# EAGLE design ampli (EAGLE 6.5.0)
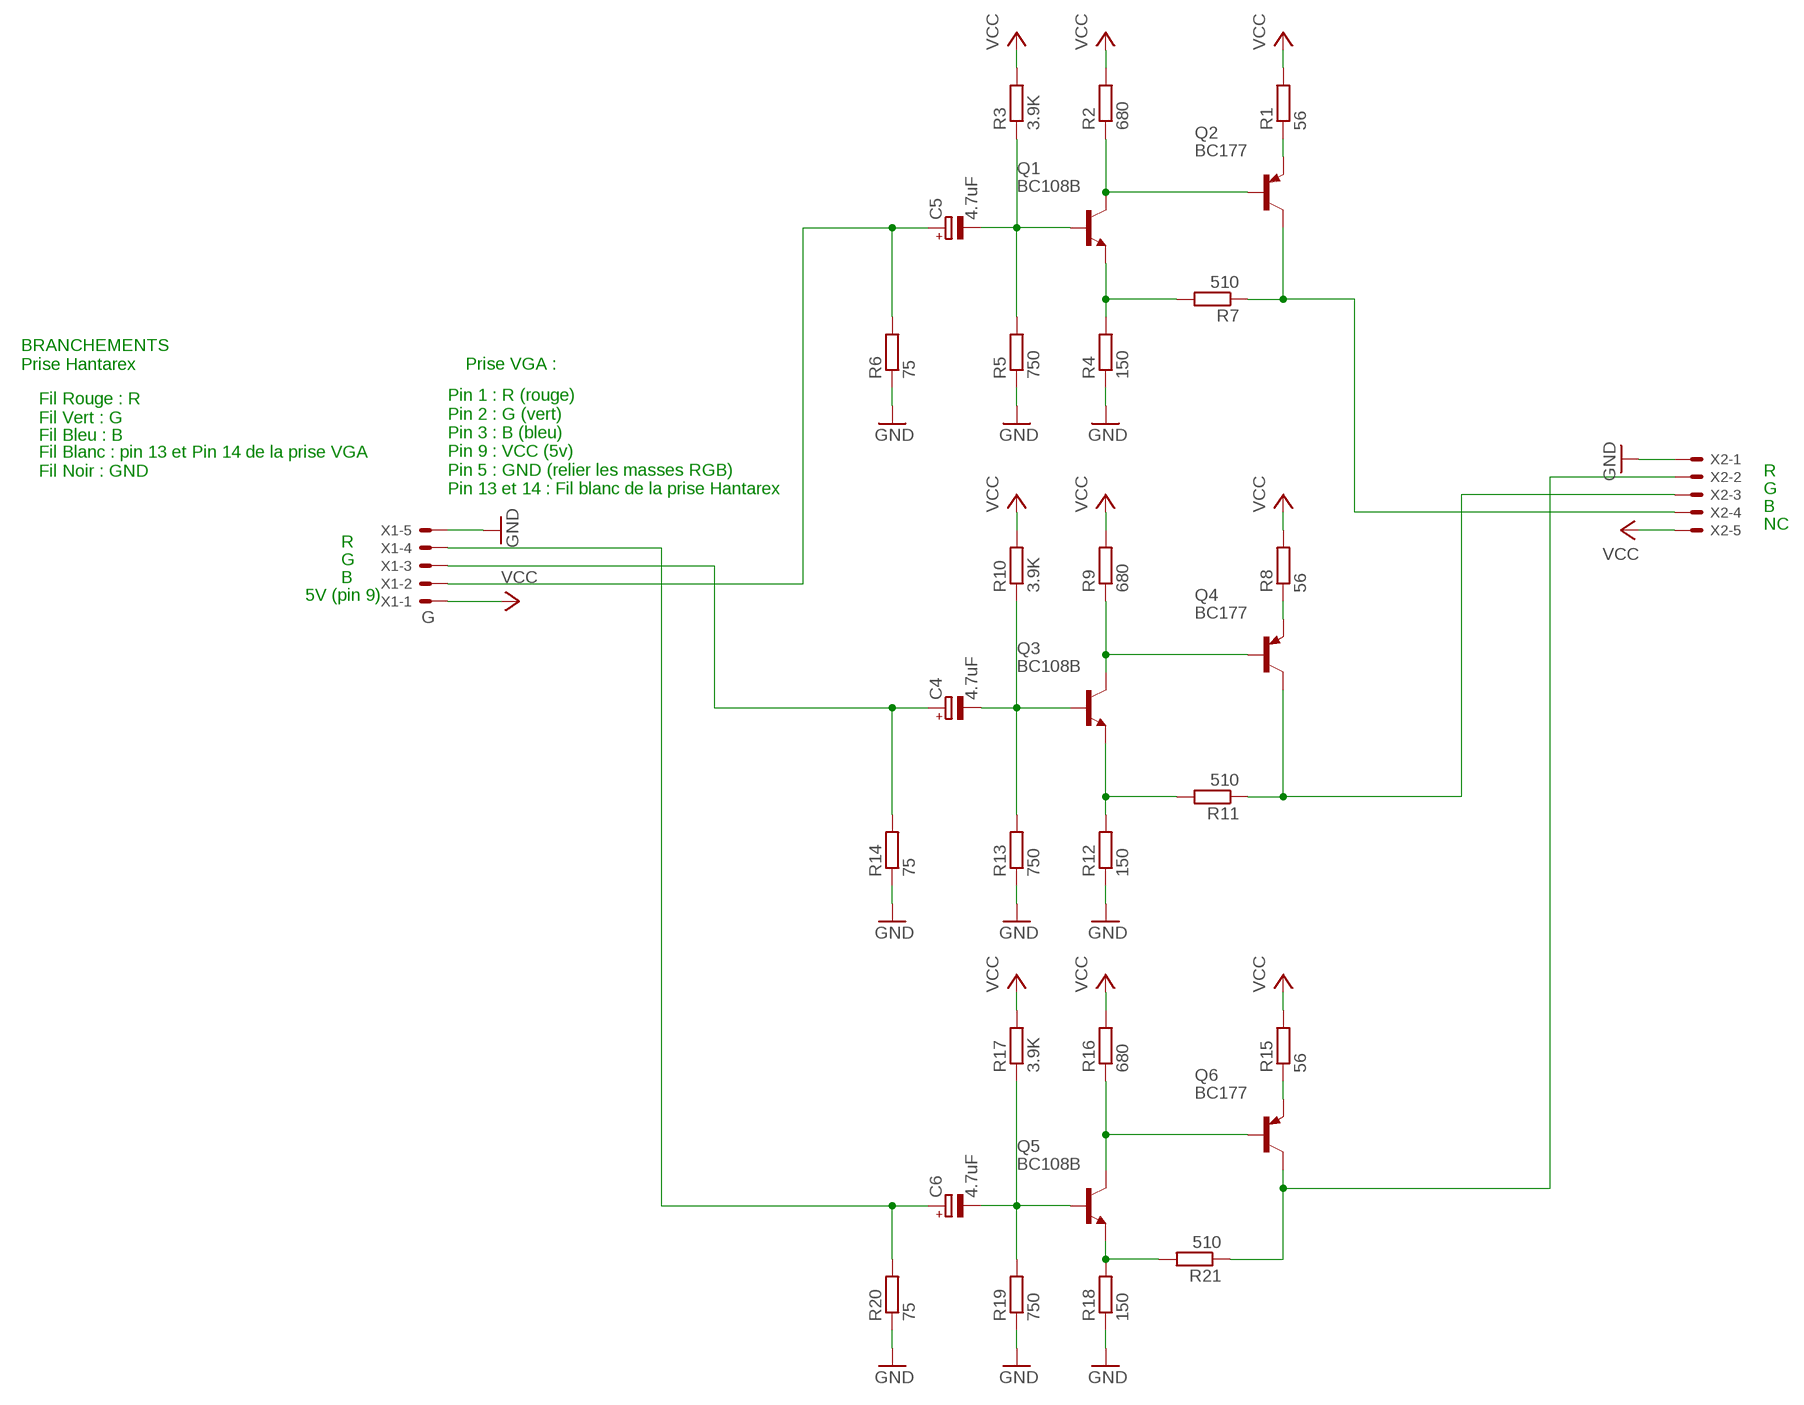
[diagram p0: schematic, sheet 1]

## Parts
C4  4.7uF  CPOL-EUE5-10.5  [E5-10,5]
C5  4.7uF  CPOL-EUE5-10.5  [E5-10,5]
C6  4.7uF  CPOL-EUE5-10.5  [E5-10,5]
Q1  BC108B  [TO18]
Q2  BC177  [TO18]
Q3  BC108B  [TO18]
Q4  BC177  [TO18]
Q5  BC108B  [TO18]
Q6  BC177  [TO18]
R1  56  R-EU_0207/10  [0207/10]
R2  680  R-EU_0207/10  [0207/10]
R3  3.9K  R-EU_0207/10  [0207/10]
R4  150  R-EU_0207/10  [0207/10]
R5  750  R-EU_0207/10  [0207/10]
R6  75  R-EU_0207/10  [0207/10]
R7  510  R-EU_0207/10  [0207/10]
R8  56  R-EU_0207/10  [0207/10]
R9  680  R-EU_0207/10  [0207/10]
R10  3.9K  R-EU_0207/10  [0207/10]
R11  510  R-EU_0207/10  [0207/10]
R12  150  R-EU_0207/10  [0207/10]
R13  750  R-EU_0207/10  [0207/10]
R14  75  R-EU_0207/10  [0207/10]
R15  56  R-EU_0207/10  [0207/10]
R16  680  R-EU_0207/10  [0207/10]
R17  3.9K  R-EU_0207/10  [0207/10]
R18  150  R-EU_0207/10  [0207/10]
R19  750  R-EU_0207/10  [0207/10]
R20  75  R-EU_0207/10  [0207/10]
R21  510  R-EU_0207/10  [0207/10]
X1  G  KK-156-5  [KK-156-5]
X2  KK-156-5  [KK-156-5]

## Nets
G: C4.+ R14.2 X1.3
GND: R4.1 R5.1 R6.1 R12.1 R13.1 R14.1 R18.1 R19.1 R20.1 X1.5 X2.1
N$1: Q1.3(C) Q2.2(B) R2.1
N$2: Q1.1(E) R4.2 R7.2
N$3: Q2.3(C) R7.1 X2.4
N$4: Q2.1(E) R1.1
N$5: C5.- Q1.2(B) R3.1 R5.2
N$6: C6.+ R20.2 X1.4
N$7: C6.- Q5.2(B) R17.1 R19.2
N$8: Q5.3(C) Q6.2(B) R16.1
N$9: Q5.1(E) R18.2 R21.2
N$10: Q6.3(C) R21.1 X2.2
N$11: Q6.1(E) R15.1
N$13: Q3.1(E) R11.2 R12.2
N$14: C4.- Q3.2(B) R10.1 R13.2
N$16: Q3.3(C) Q4.2(B) R9.1
N$17: Q4.3(C) R11.1 X2.3
N$18: Q4.1(E) R8.1
R: C5.+ R6.2 X1.2
VCC: R1.2 R2.2 R3.2 R8.2 R9.2 R10.2 R15.2 R16.2 R17.2 X1.1 X2.5

## Notes on the sheet
- BRANCHEMENTS
  Prise Hantarex
- Prise VGA :
- Fil Rouge : R
  Fil Vert : G
- Fil Bleu : B
- Fil Blanc : pin 13 et Pin 14 de la prise VGA
  Fil Noir : GND
- R
- Pin 1 : R (rouge)
  Pin 2 : G (vert)
  Pin 3 : B (bleu)
  Pin 9 : VCC (5v)
  Pin 5 : GND (relier les masses RGB)
  Pin 13 et 14 : Fil blanc de la prise Hantarex
- G
- B
- NC
- R
- G
- B
- 5V (pin 9)

## Library data of the parts
C4-C6 = resistor:CPOL-EU: POLARIZED CAPACITOR, European symbol
Q1 Q3 Q5 = transistor-npn:BC108B: NPN Transistor
Q2 Q4 Q6 = transistor-pnp:BC177*: PNP Transistor
R1-R21 = resistor:R-EU_: RESISTOR, European symbol
X1 X2 = con-molex:KK-156-5: KK 156 HEADER Source: http://www.molex.com/pdm_docs/sd/026604100_sd.pdf; OC_FARNELL: unknown; OC_NEWARK: unknown

## Board
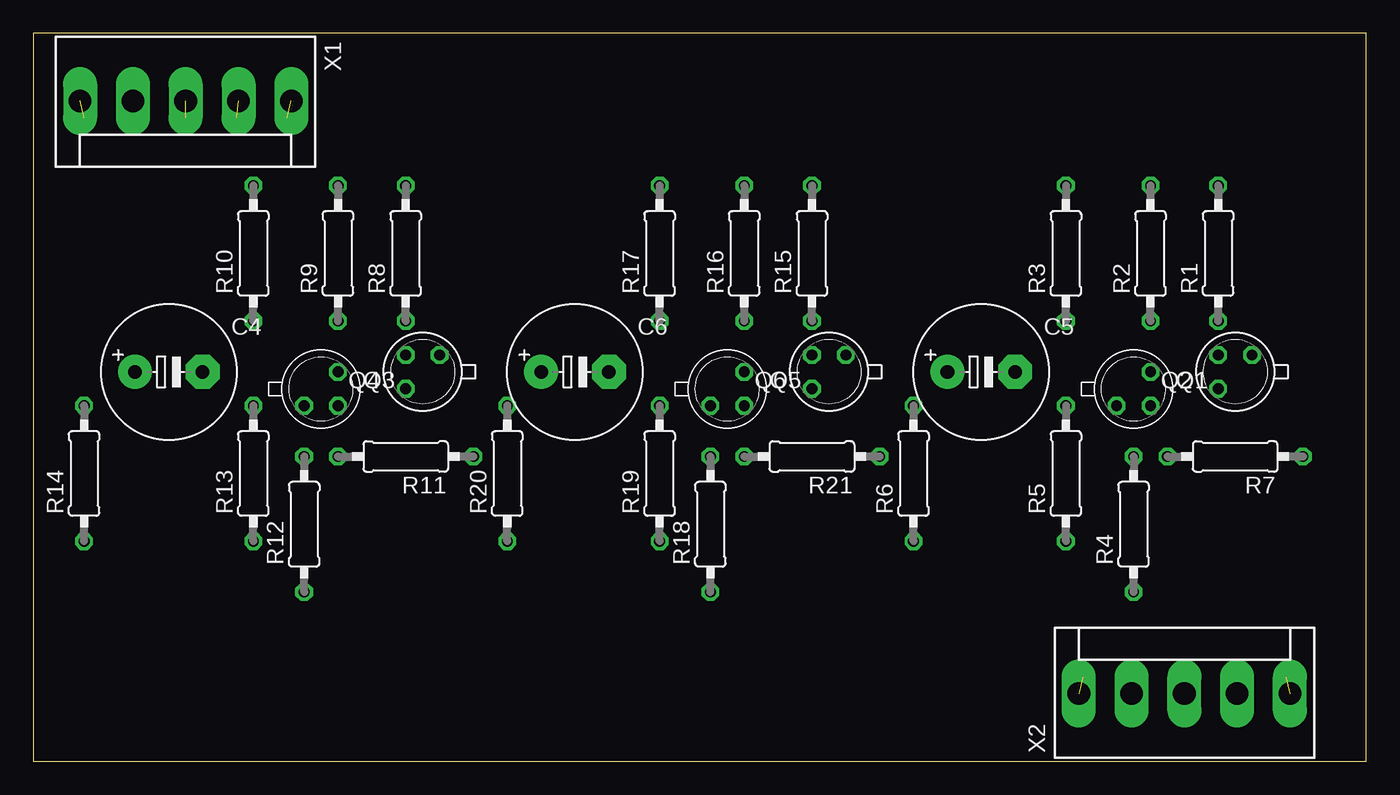
[diagram p1: board, top side]
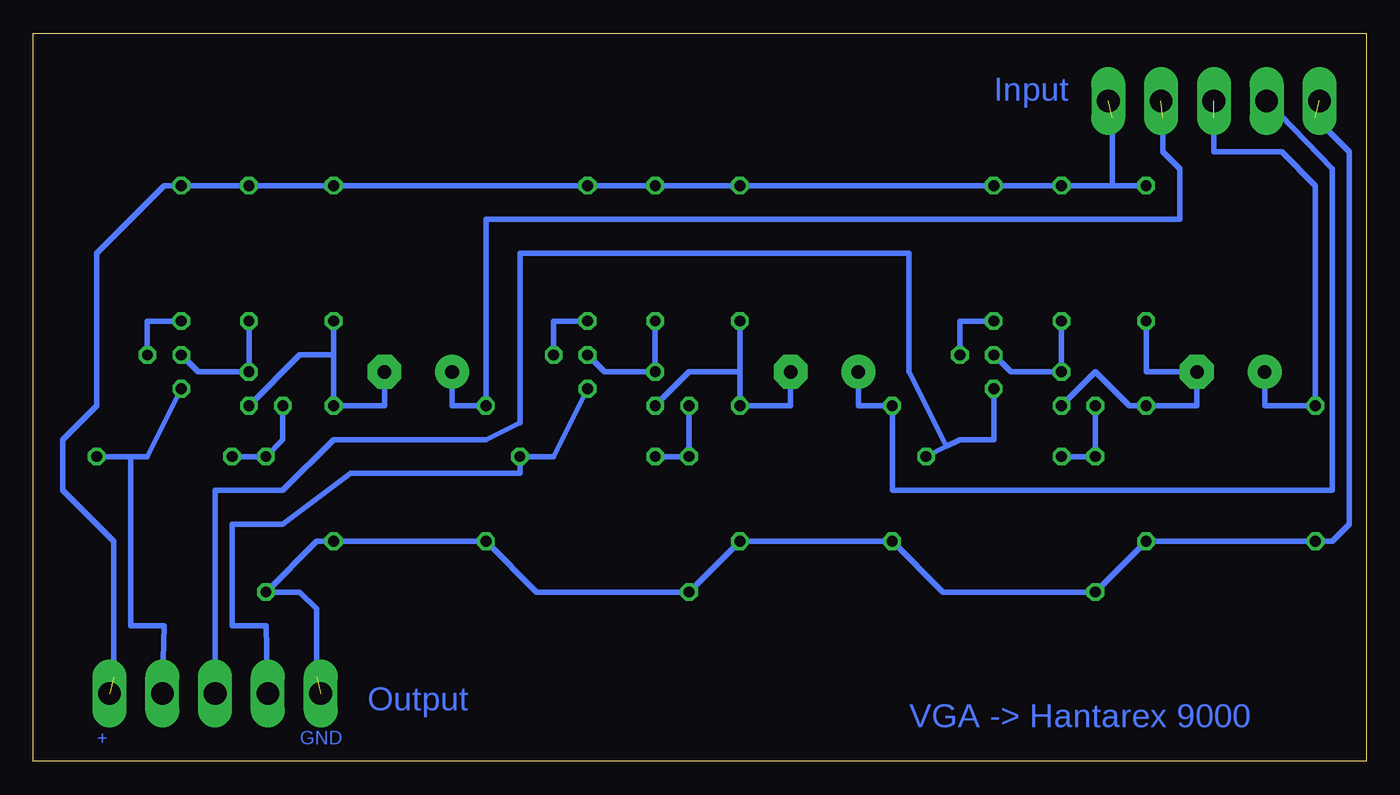
[diagram p2: board, bottom side, seen from below]

Size 100 x 54.6 mm. Coordinates in mm from the lower left corner, seen from the top.
Outline: 0,0 100,0 100,54.6 0,54.6 0,0
Copper layers (1*16): Top 0.035mm / dielectric 1.5mm / Bottom 0.035mm
Design rules "default": minimum track width 10mil, minimum drill 24mil, track to track 8mil, track to pad 8mil, pad to pad 8mil, via to via 8mil, smd to smd 8mil, copper to edge 40mil, drill to drill 8mil, minimum pad ring 10mil, minimum via ring 8mil, stop-mask expansion 4mil, vias tented up to drill 0mil, thermal gap 10mil

### Footprints (pad centres in the part's own frame; a part is rotated, then mirrored left to right if it is on the bottom)
E5-10,5 = drill 1.016 pad 2.54: + -2.54,0 | drill 1.016 pad 2.54 octagon: - 2.54,0
TO18 = drill 0.813 octagon: 1 -1.27,-1.27; 2 1.27,-1.27; 3 1.27,1.27
0207/10 = drill 0.813 octagon: 1 -5.08,0; 2 5.08,0
KK-156-5 = drill 1.7 pad 2.184 long: 1 -7.92,0; 2 -3.96,0; 3 0,0; 4 3.96,0; 5 7.92,0

### Placement (x,y rotation side)
C4  10.16,29.21 0 top
C5  71.12,29.21 0 top
C6  40.64,29.21 0 top
Q1  82.55,27.94 0 top
Q2  90.17,29.21 180 top
Q3  21.59,27.94 0 top
Q4  29.21,29.21 180 top
Q5  52.07,27.94 0 top
Q6  59.69,29.21 180 top
R1  88.9,38.1 90 top
R2  83.82,38.1 90 top
R3  77.47,38.1 90 top
R4  82.55,17.78 90 top
R5  77.47,21.59 90 top
R6  66.04,21.59 90 top
R7  90.17,22.86 180 top
R8  27.94,38.1 90 top
R9  22.86,38.1 90 top
R10  16.51,38.1 90 top
R11  27.94,22.86 180 top
R12  20.32,17.78 90 top
R13  16.51,21.59 90 top
R14  3.81,21.59 90 top
R15  58.42,38.1 90 top
R16  53.34,38.1 90 top
R17  46.99,38.1 90 top
R18  50.8,17.78 90 top
R19  46.99,21.59 90 top
R20  35.56,21.59 90 top
R21  58.42,22.86 180 top
X1  11.43,49.53 180 top
X2  86.36,5.08 0 top

### Tracks (layer width: path | path; a pad name or v marks a point on that pad's centre or on a via)
G  (1 unrouted)
  Bottom 0.406: C4.+ 7.62,26.67 R14.2 3.81,43.18 6.35,45.72 11.43,45.72 11.43,48.26
GND  (2 unrouted)
  Bottom 0.406: 78.74,6.35 78.74,11.43 80.01,12.7 R4.1 78.74,16.51 R5.1 R6.1 62.23,12.7 R18.1 R19.1 R20.1 31.75,12.7 R12.1 R13.1 R14.1 2.54,16.51 1.27,17.78 1.27,45.72 3.81,48.26
N$1
  Bottom 0.406: Q2.2 87.63,29.21 Q1.3 R2.1
N$2
  Bottom 0.406: Q1.1 81.28,24.13 R4.2 R7.2
N$3
  Bottom 0.406: 92.71,22.86 91.44,22.86 Q2.3 | 92.71,22.86 R7.1 | X2.4 90.17,10.16 92.71,10.16 92.71,22.86
N$4
  Bottom 0.406: Q2.1 91.44,33.02 R1.1
N$5
  Bottom 0.406: C5.- 73.66,26.67 R5.2 77.47,30.48 | 77.47,30.48 R3.1 | 77.47,30.48 80.01,30.48 Q1.2
N$6
  Bottom 0.406: C6.+ 38.1,26.67 R20.2 35.56,20.32 2.54,20.32 2.54,44.45 X1.4
N$7
  Bottom 0.406: C6.- 43.18,26.67 R19.2 46.99,29.21 | R17.1 46.99,29.21 | 46.99,29.21 50.8,29.21 Q5.2
N$8
  Bottom 0.406: Q6.2 57.15,29.21 Q5.3 R16.1
N$9
  Bottom 0.406: Q5.1 R18.2 R21.2
N$10
  Bottom 0.406: Q6.3 60.96,22.86 R21.1 63.5,21.59 76.2,21.59 81.28,17.78 85.09,17.78 85.09,10.16 82.55,10.16 X2.2
N$11
  Bottom 0.406: Q6.1 60.96,33.02 R15.1
N$13
  Bottom 0.406: Q3.1 R12.2 R11.2
N$14
  Bottom 0.406: R10.1 16.51,29.21 C4.- 12.7,26.67 R13.2 17.78,26.67 20.32,29.21 Q3.2
N$16
  Bottom 0.406: R9.1 Q3.3 26.67,29.21 Q4.2
N$17
  Bottom 0.406: 31.5,23.62 30.48,24.13 27.94,24.13 Q4.3 | 31.5,23.62 R11.1 | X2.3 86.36,20.32 81.28,20.32 77.47,24.13 66.04,24.13 63.5,25.4 63.5,38.1 34.29,38.1 34.29,29.21 31.5,23.62
N$18
  Bottom 0.406: Q4.1 30.48,33.02 R8.1
R  (1 unrouted)
  Bottom 0.406: C5.+ 68.58,26.67 R6.2 66.04,40.64 13.97,40.64 13.97,44.45 15.24,45.72 15.24,48.26
VCC  (2 unrouted)
  Bottom 0.406: 19.05,43.18 R9.2 R8.2 R17.2 R16.2 R15.2 R3.2 R2.2 R1.2 90.17,43.18 95.25,38.1 95.25,26.67 97.79,24.13 97.79,20.32 93.98,16.51 93.98,6.35 | R10.2 19.05,43.18 | 19.05,43.18 19.05,48.26

### Text on the board
Bottom: Input | Output | VGA -> Hantarex 9000 | GND | +